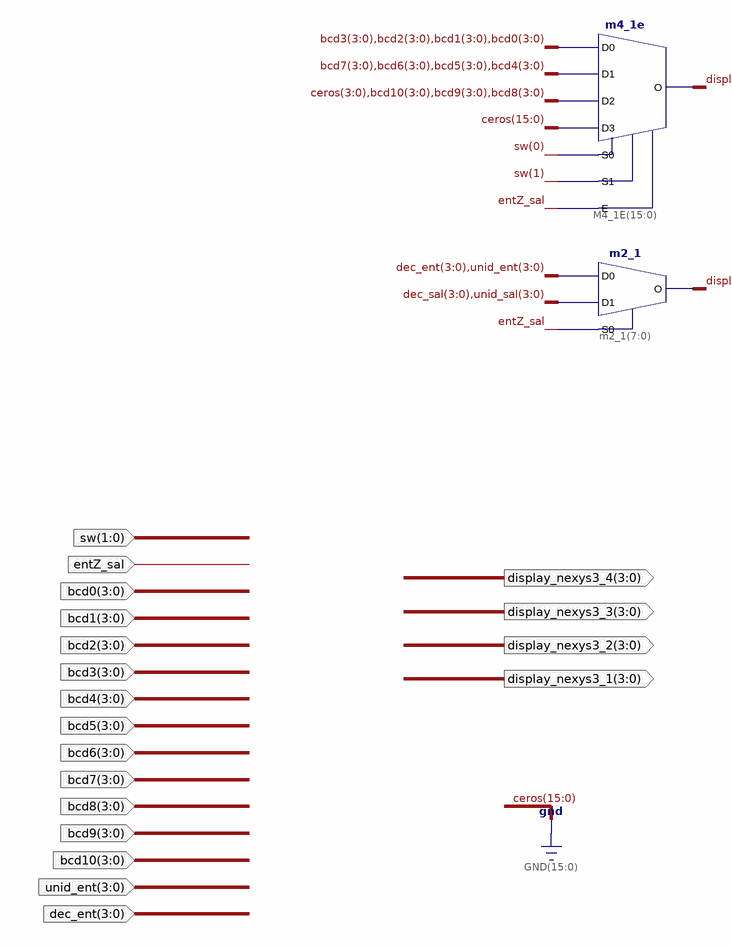
[diagram p0: schematic sheet 1]
// Xilinx ISE schematic mux_displays_7seg.sch (spartan6) as structural Verilog: 2 symbols, 19 ports
module mux_displays_7seg (
  input  entZ_sal,
  input  [3:0] bcd0,
  input  [3:0] bcd1,
  input  [3:0] bcd2,
  input  [3:0] bcd3,
  input  [3:0] bcd4,
  input  [3:0] bcd5,
  input  [3:0] bcd6,
  input  [3:0] bcd7,
  input  [3:0] bcd8,
  input  [3:0] bcd9,
  input  [3:0] bcd10,
  input  [1:0] sw,
  input  [3:0] unid_ent,
  input  [3:0] dec_ent,
  output [3:0] display_nexys3_4,
  output [3:0] display_nexys3_2,
  output [3:0] display_nexys3_3,
  output [3:0] display_nexys3_1
);

  wire [3:0] dec_sal, unid_sal;

  m4_1e M4_1E[15:0] (
    .D0({bcd3, bcd2, bcd1, bcd0}), .D1({bcd7, bcd6, bcd5, bcd4}), .D2({4'b0000, bcd10, bcd9, bcd8}),
    .D3({16{1'b0}}), .E(entZ_sal), .S0(sw[0]), .S1(sw[1]),
    .O({display_nexys3_4, display_nexys3_3, dec_sal, unid_sal}));
  m2_1 m2_1[7:0] (
    .D0({dec_ent, unid_ent}), .D1({dec_sal, unid_sal}), .S0(entZ_sal),
    .O({display_nexys3_2, display_nexys3_1}));
endmodule
